# Altium project Task_4.PrjPcb
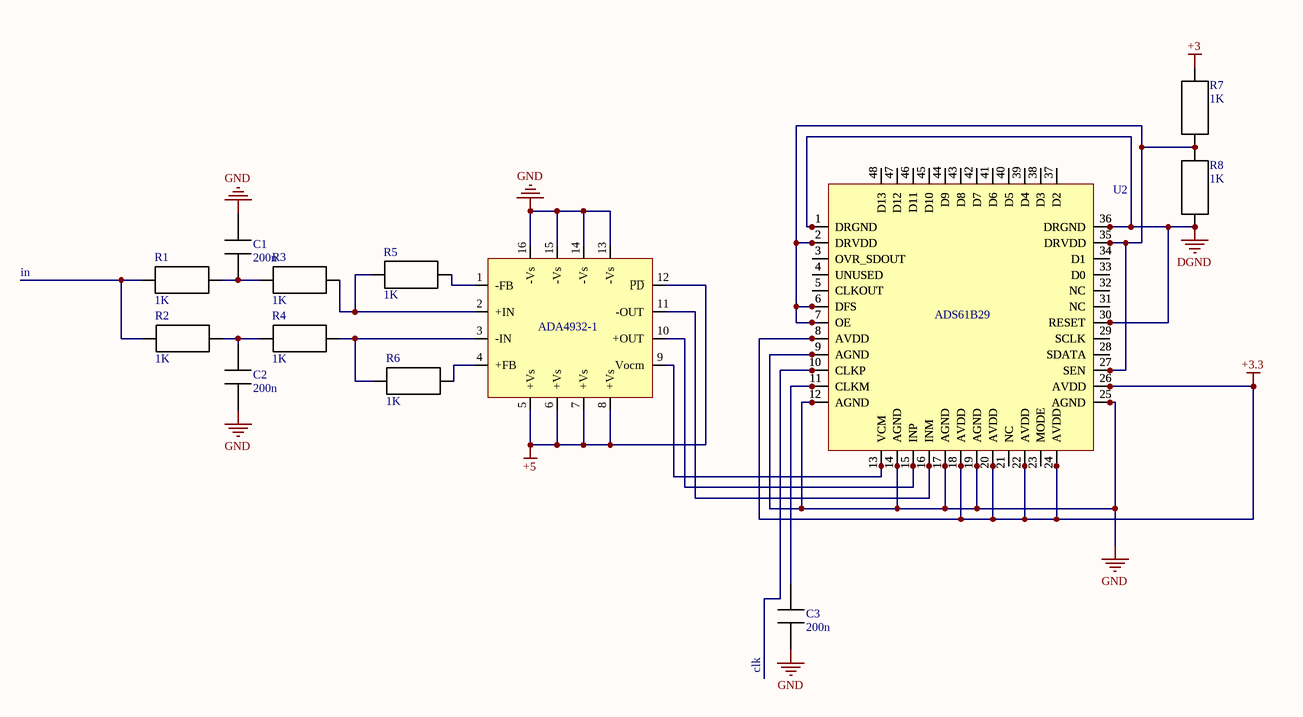
[diagram p0: Sheet1.SchDoc]
1 sheet, 13 parts. Net scope: global (net labels, ports and power ports of the same name join across sheets).
Board file: Task_5.PcbDoc

## Sheet Sheet1.SchDoc
size A4; SheetNumber: 1; SheetTotal: 1

### Parts
C1  value 200n  [C]  (hidden comment: С)
C2  value 200n  [C]  (hidden comment: С)
C3  value 200n  [C]  (hidden comment: С)
R1  value 1K  [R]  (hidden comment: R)
R2  value 1K  [R]  (hidden comment: R)
R3  value 1K  [R]  (hidden comment: R)
R4  value 1K  [R]  (hidden comment: R)
R5  value 1K  [R]  (hidden comment: R)
R6  value 1K  [R]  (hidden comment: R)
R7  value 1K  [R]  (hidden comment: R)
R8  value 1K  [R]  (hidden comment: R)
U1  ADA4932-1  [ADA4932]  (value not drawn)
U2  ADS61B29  [ADS61B29]  (value not drawn)

### Nets
+3: R7.1
+3.3: U2.8(AVDD) U2.18(AVDD) U2.20(AVDD) U2.22(AVDD) U2.24(AVDD) U2.26(AVDD)
+5: U1.5(+Vs) U1.6(+Vs) U1.7(+Vs) U1.8(+Vs) U1.12(P̅D̅)
DGND: R8.2 U2.1(DRGND) U2.30(RESET) U2.36(DRGND)
GND: C1.2 C2.2 C3.2 U1.13(-Vs) U1.14(-Vs) U1.15(-Vs) U1.16(-Vs) U2.9(AGND) U2.12(AGND) U2.14(AGND) U2.17(AGND) U2.19(AGND) U2.25(AGND)
NetC1_1: C1.1 R1.2 R3.1
NetC2_1: C2.1 R2.2 R4.1
NetC3_1: C3.1 U2.11(CLKM)
NetR1_1: R1.1 R2.1
NetR3_2: R3.2 R5.2 U1.2(+IN)
NetR4_2: R4.2 R6.2 U1.3(-IN)
NetR5_1: R5.1 U1.1(-FB)
NetR6_1: R6.1 U1.4(+FB)
NetR7_2: R7.2 R8.1 U2.2(DRVDD) U2.6(DFS) U2.7(OE) U2.27(SEN) U2.35(DRVDD)
NetU1_9: U1.9(Vocm) U2.13(VCM)
NetU1_10: U1.10(+OUT) U2.15(INP)
NetU1_11: U1.11(-OUT) U2.16(INM)

Not connected (* = marked no-connect by the designer): U2 3(OVR_SDOUT) 4(UNUSED) 5(CLKOUT) 10(CLKP) 21(NC) 23(MODE) 28(SDATA) 29(SCLK) 31(NC) 32(NC) 33(D0) 34(D1) 37(D2) 38(D3) 39(D4) 40(D5) 41(D6) 42(D7) 43(D8) 44(D9) 45(D10) 46(D11) 47(D12) 48(D13)

### Notes on the sheet
- in
- (near C3) clk